# EAGLE design DenScript 5x5 Strip Board (EAGLE 9.3.0)
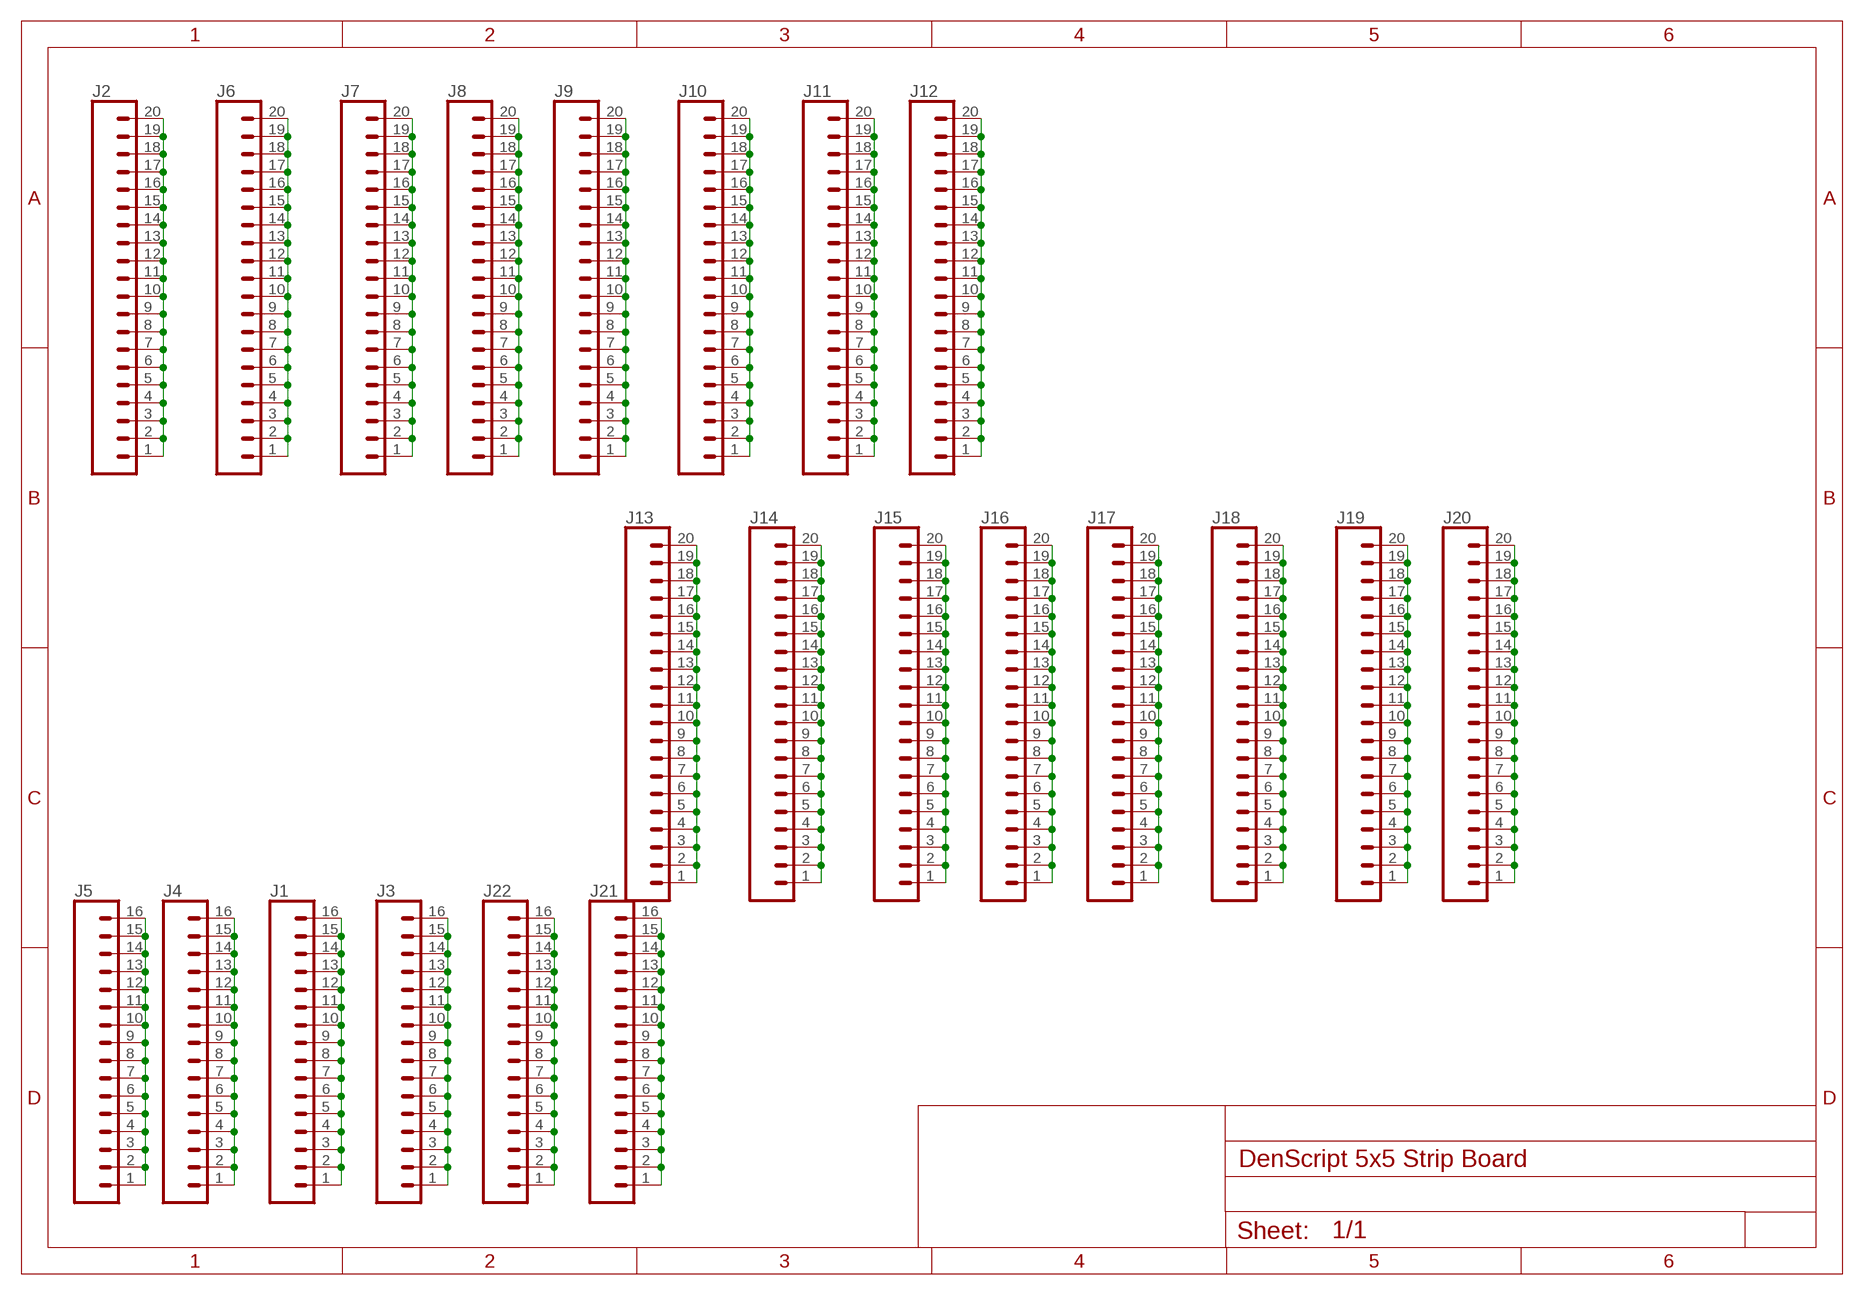
[diagram p0: schematic, sheet 1]

## Parts
J1  CONN_161X16_NO_SILK  [1X16_NO_SILK]
J2  CONN_20NOSILK  [1X20_NOSILK]
J3  CONN_161X16_NO_SILK  [1X16_NO_SILK]
J4  CONN_161X16_NO_SILK  [1X16_NO_SILK]
J5  CONN_161X16_NO_SILK  [1X16_NO_SILK]
J6  CONN_20NOSILK  [1X20_NOSILK]
J7  CONN_20NOSILK  [1X20_NOSILK]
J8  CONN_20NOSILK  [1X20_NOSILK]
J9  CONN_20NOSILK  [1X20_NOSILK]
J10  CONN_20NOSILK  [1X20_NOSILK]
J11  CONN_20NOSILK  [1X20_NOSILK]
J12  CONN_20NOSILK  [1X20_NOSILK]
J13  CONN_20NOSILK  [1X20_NOSILK]
J14  CONN_20NOSILK  [1X20_NOSILK]
J15  CONN_20NOSILK  [1X20_NOSILK]
J16  CONN_20NOSILK  [1X20_NOSILK]
J17  CONN_20NOSILK  [1X20_NOSILK]
J18  CONN_20NOSILK  [1X20_NOSILK]
J19  CONN_20NOSILK  [1X20_NOSILK]
J20  CONN_20NOSILK  [1X20_NOSILK]
J21  CONN_161X16_NO_SILK  [1X16_NO_SILK]
J22  CONN_161X16_NO_SILK  [1X16_NO_SILK]

## Nets
N$1: J3.1 J3.2 J3.3 J3.4 J3.5 J3.6 J3.7 J3.8 J3.9 J3.10 J3.11 J3.12 J3.13 J3.14 J3.15 J3.16
N$2: J1.1 J1.2 J1.3 J1.4 J1.5 J1.6 J1.7 J1.8 J1.9 J1.10 J1.11 J1.12 J1.13 J1.14 J1.15 J1.16
N$3: J4.1 J4.2 J4.3 J4.4 J4.5 J4.6 J4.7 J4.8 J4.9 J4.10 J4.11 J4.12 J4.13 J4.14 J4.15 J4.16
N$4: J5.1 J5.2 J5.3 J5.4 J5.5 J5.6 J5.7 J5.8 J5.9 J5.10 J5.11 J5.12 J5.13 J5.14 J5.15 J5.16
N$5: J2.1 J2.2 J2.3 J2.4 J2.5 J2.6 J2.7 J2.8 J2.9 J2.10 J2.11 J2.12 J2.13 J2.14 J2.15 J2.16 J2.17 J2.18 J2.19 J2.20
N$6: J6.1 J6.2 J6.3 J6.4 J6.5 J6.6 J6.7 J6.8 J6.9 J6.10 J6.11 J6.12 J6.13 J6.14 J6.15 J6.16 J6.17 J6.18 J6.19 J6.20
N$7: J7.1 J7.2 J7.3 J7.4 J7.5 J7.6 J7.7 J7.8 J7.9 J7.10 J7.11 J7.12 J7.13 J7.14 J7.15 J7.16 J7.17 J7.18 J7.19 J7.20
N$8: J8.1 J8.2 J8.3 J8.4 J8.5 J8.6 J8.7 J8.8 J8.9 J8.10 J8.11 J8.12 J8.13 J8.14 J8.15 J8.16 J8.17 J8.18 J8.19 J8.20
N$9: J9.1 J9.2 J9.3 J9.4 J9.5 J9.6 J9.7 J9.8 J9.9 J9.10 J9.11 J9.12 J9.13 J9.14 J9.15 J9.16 J9.17 J9.18 J9.19 J9.20
N$10: J10.1 J10.2 J10.3 J10.4 J10.5 J10.6 J10.7 J10.8 J10.9 J10.10 J10.11 J10.12 J10.13 J10.14 J10.15 J10.16 J10.17 J10.18 J10.19 J10.20
N$11: J11.1 J11.2 J11.3 J11.4 J11.5 J11.6 J11.7 J11.8 J11.9 J11.10 J11.11 J11.12 J11.13 J11.14 J11.15 J11.16 J11.17 J11.18 J11.19 J11.20
N$12: J12.1 J12.2 J12.3 J12.4 J12.5 J12.6 J12.7 J12.8 J12.9 J12.10 J12.11 J12.12 J12.13 J12.14 J12.15 J12.16 J12.17 J12.18 J12.19 J12.20
N$13: J13.1 J13.2 J13.3 J13.4 J13.5 J13.6 J13.7 J13.8 J13.9 J13.10 J13.11 J13.12 J13.13 J13.14 J13.15 J13.16 J13.17 J13.18 J13.19 J13.20
N$14: J14.1 J14.2 J14.3 J14.4 J14.5 J14.6 J14.7 J14.8 J14.9 J14.10 J14.11 J14.12 J14.13 J14.14 J14.15 J14.16 J14.17 J14.18 J14.19 J14.20
N$15: J15.1 J15.2 J15.3 J15.4 J15.5 J15.6 J15.7 J15.8 J15.9 J15.10 J15.11 J15.12 J15.13 J15.14 J15.15 J15.16 J15.17 J15.18 J15.19 J15.20
N$16: J16.1 J16.2 J16.3 J16.4 J16.5 J16.6 J16.7 J16.8 J16.9 J16.10 J16.11 J16.12 J16.13 J16.14 J16.15 J16.16 J16.17 J16.18 J16.19 J16.20
N$17: J17.1 J17.2 J17.3 J17.4 J17.5 J17.6 J17.7 J17.8 J17.9 J17.10 J17.11 J17.12 J17.13 J17.14 J17.15 J17.16 J17.17 J17.18 J17.19 J17.20
N$18: J18.1 J18.2 J18.3 J18.4 J18.5 J18.6 J18.7 J18.8 J18.9 J18.10 J18.11 J18.12 J18.13 J18.14 J18.15 J18.16 J18.17 J18.18 J18.19 J18.20
N$19: J19.1 J19.2 J19.3 J19.4 J19.5 J19.6 J19.7 J19.8 J19.9 J19.10 J19.11 J19.12 J19.13 J19.14 J19.15 J19.16 J19.17 J19.18 J19.19 J19.20
N$20: J20.1 J20.2 J20.3 J20.4 J20.5 J20.6 J20.7 J20.8 J20.9 J20.10 J20.11 J20.12 J20.13 J20.14 J20.15 J20.16 J20.17 J20.18 J20.19 J20.20
N$21: J21.1 J21.2 J21.3 J21.4 J21.5 J21.6 J21.7 J21.8 J21.9 J21.10 J21.11 J21.12 J21.13 J21.14 J21.15 J21.16
N$22: J22.1 J22.2 J22.3 J22.4 J22.5 J22.6 J22.7 J22.8 J22.9 J22.10 J22.11 J22.12 J22.13 J22.14 J22.15 J22.16

## Library data of the parts
J1 J3-J5 J21 J22 = SparkFun-Connectors:CONN_16: Multi connection point. Often used as Generic Header-pin footprint for 0.1 inch spaced/style header connections On any of the 0.1 inch spaced packages, you can populate with these: Break Away Headers - Straight <https://www.sparkfun.com/products/116> (PRT-00116) Break Away Male Headers - Right Angle <https://www.sparkfun.com/products/553> (PRT-00553) Female Headers <https://www.sparkfun.com/products/115> (PRT-00115) Break Away Headers - Machine Pin <https://www.sparkfun.com/products/117> (PRT-00117) Break Away Female Headers - Swiss Machine Pin <https://www.sparkfun.com/products/743> (PRT-00743) For SCREWTERMINALS and SPRING TERMINALS visit here: Screw Terimnals on SparkFun.com <https://www.sparkfun.com/search/results?term=Screw+Terminals> (5mm/3.5mm/2.54mm spacing) This device is also useful as a general connection point to wire up your design to another part of your project. Our various solder wires solder well into these plated through hole pads. Hook-Up Wire - Assortment (Stranded, 22 AWG) <https://www.sparkfun.com/products/11375> (PRT-11375) Hook-Up Wire - Assortment (Solid Core, 22 AWG) <https://www.sparkfun.com/products/11367> (PRT-11367) View the entire wire category on our website here <https://www.sparkfun.com/categories/141> Special notes: Molex polarized connector foot print use with SKU : PRT-08231 with associated crimp pins and housings. 1MM SMD Version SKU: PRT-10208 NOTES ON THE VARIANTS LOCK and LOCK_LONGPADS... This footprint was designed to help hold the alignment of a through-hole component (i.e. 6-pin header) while soldering it into place. You may notice that each hole has been shifted either up or down by 0.005 of an inch from it's more standard position (which is a perfectly straight line). This slight alteration caused the pins (the squares in the middle) to touch the edges of the holes. Because they are alternating, it causes a "brace" to hold the component in place. 0.005 has proven to be the perfect amount of "off-center" position when using our standard breakaway headers. Although looks a little odd when you look at the bare footprint, once you have a header in there, the alteration is very hard to notice. Also,if you push a header all the way into place, it is covered up entirely on the bottom side.
J2 J6-J20 = SparkFun-Connectors:CONN_20: Multi connection point. Often used as Generic Header-pin footprint for 0.1 inch spaced/style header connections On any of the 0.1 inch spaced packages, you can populate with these: Break Away Headers - Straight <https://www.sparkfun.com/products/116> (PRT-00116) Break Away Male Headers - Right Angle <https://www.sparkfun.com/products/553> (PRT-00553) Female Headers <https://www.sparkfun.com/products/115> (PRT-00115) Break Away Headers - Machine Pin <https://www.sparkfun.com/products/117> (PRT-00117) Break Away Female Headers - Swiss Machine Pin <https://www.sparkfun.com/products/743> (PRT-00743) For SCREWTERMINALS and SPRING TERMINALS visit here: Screw Terimnals on SparkFun.com <https://www.sparkfun.com/search/results?term=Screw+Terminals> (5mm/3.5mm/2.54mm spacing) This device is also useful as a general connection point to wire up your design to another part of your project. Our various solder wires solder well into these plated through hole pads. Hook-Up Wire - Assortment (Stranded, 22 AWG) <https://www.sparkfun.com/products/11375> (PRT-11375) Hook-Up Wire - Assortment (Solid Core, 22 AWG) <https://www.sparkfun.com/products/11367> (PRT-11367) View the entire wire category on our website here <https://www.sparkfun.com/categories/141> Special notes: Molex polarized connector foot print use with SKU : PRT-08231 with associated crimp pins and housings. 1MM SMD Version SKU: PRT-10208 NOTES ON THE VARIANTS LOCK and LOCK_LONGPADS... This footprint was designed to help hold the alignment of a through-hole component (i.e. 6-pin header) while soldering it into place. You may notice that each hole has been shifted either up or down by 0.005 of an inch from it's more standard position (which is a perfectly straight line). This slight alteration caused the pins (the squares in the middle) to touch the edges of the holes. Because they are alternating, it causes a "brace" to hold the component in place. 0.005 has proven to be the perfect amount of "off-center" position when using our standard breakaway headers. Although looks a little odd when you look at the bare footprint, once you have a header in there, the alteration is very hard to notice. Also,if you push a header all the way into place, it is covered up entirely on the bottom side. Note about LOCK SPECIAL package: This is just like the LOCK variant in that the holes are staggared by 5 mil, but except for the last two holes. They are not altered from the "standard" footprint layout. This is used for a special purpose on the layout of our Graphic LCD Backpack. Make sure you want to use this device before selecting it for you project!

## Board
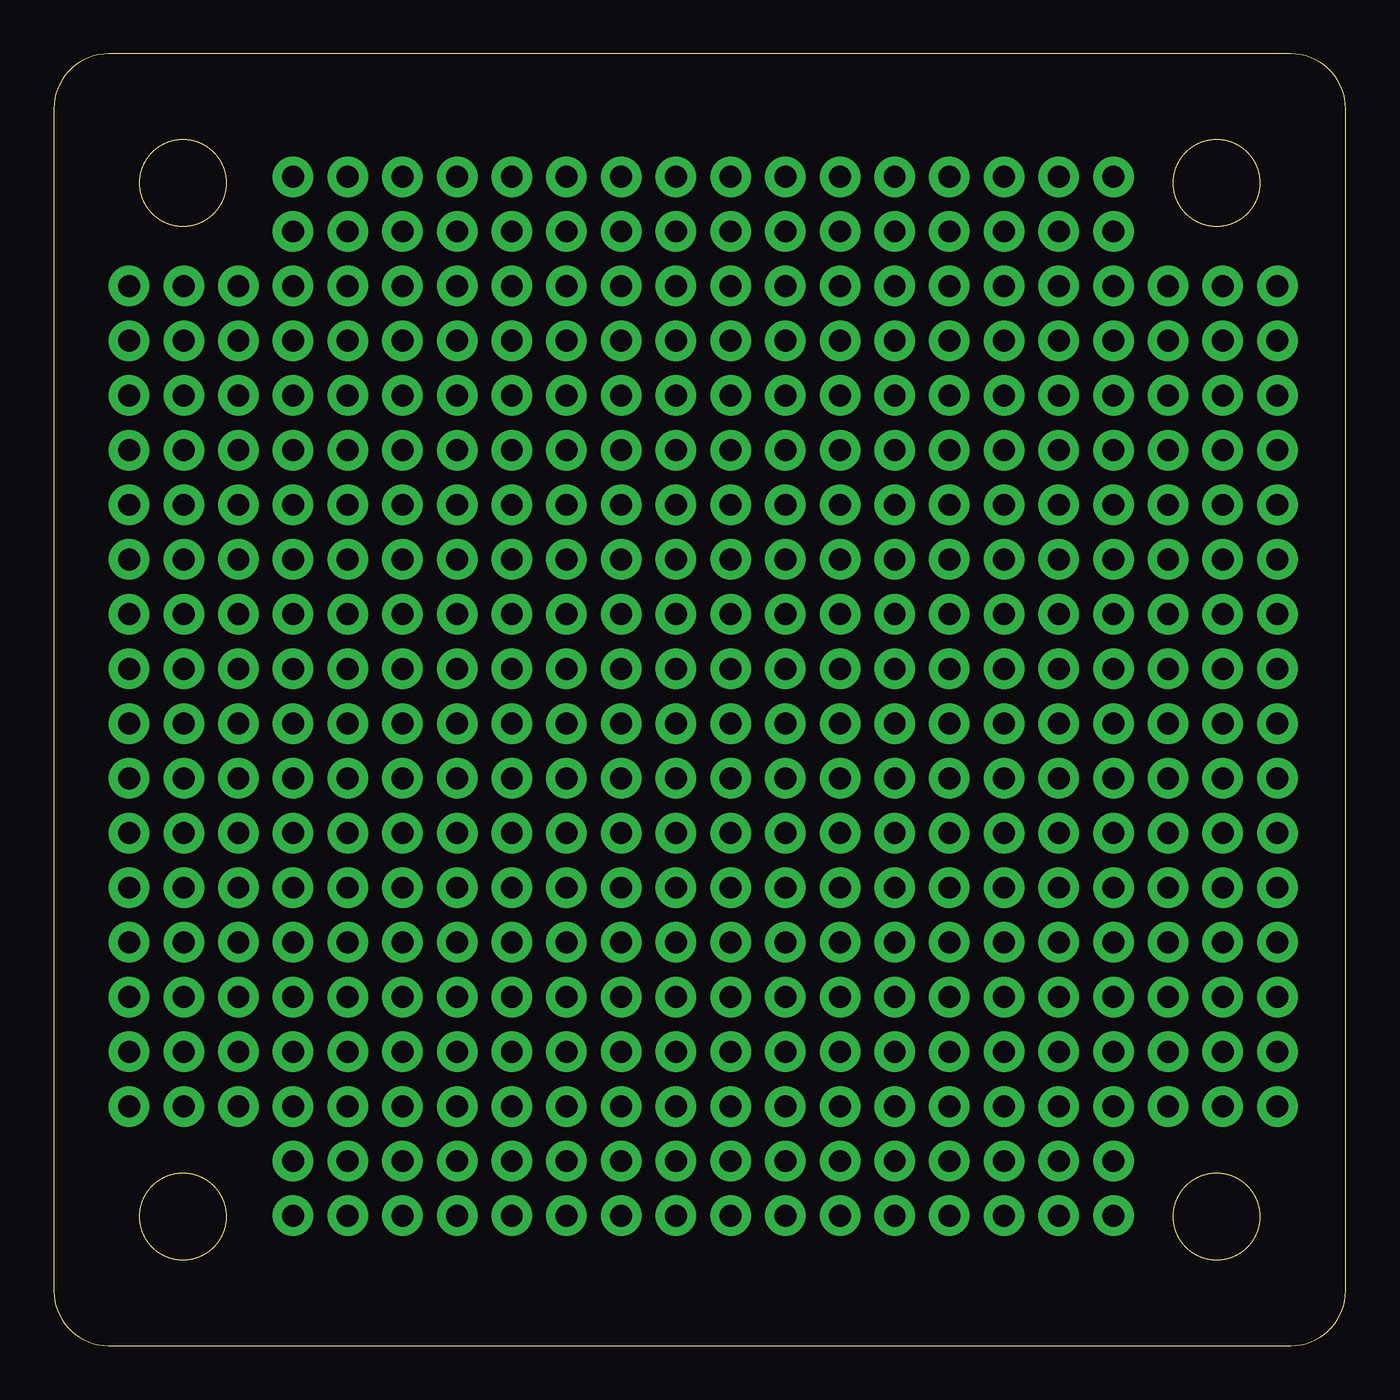
[diagram p1: board, top side]
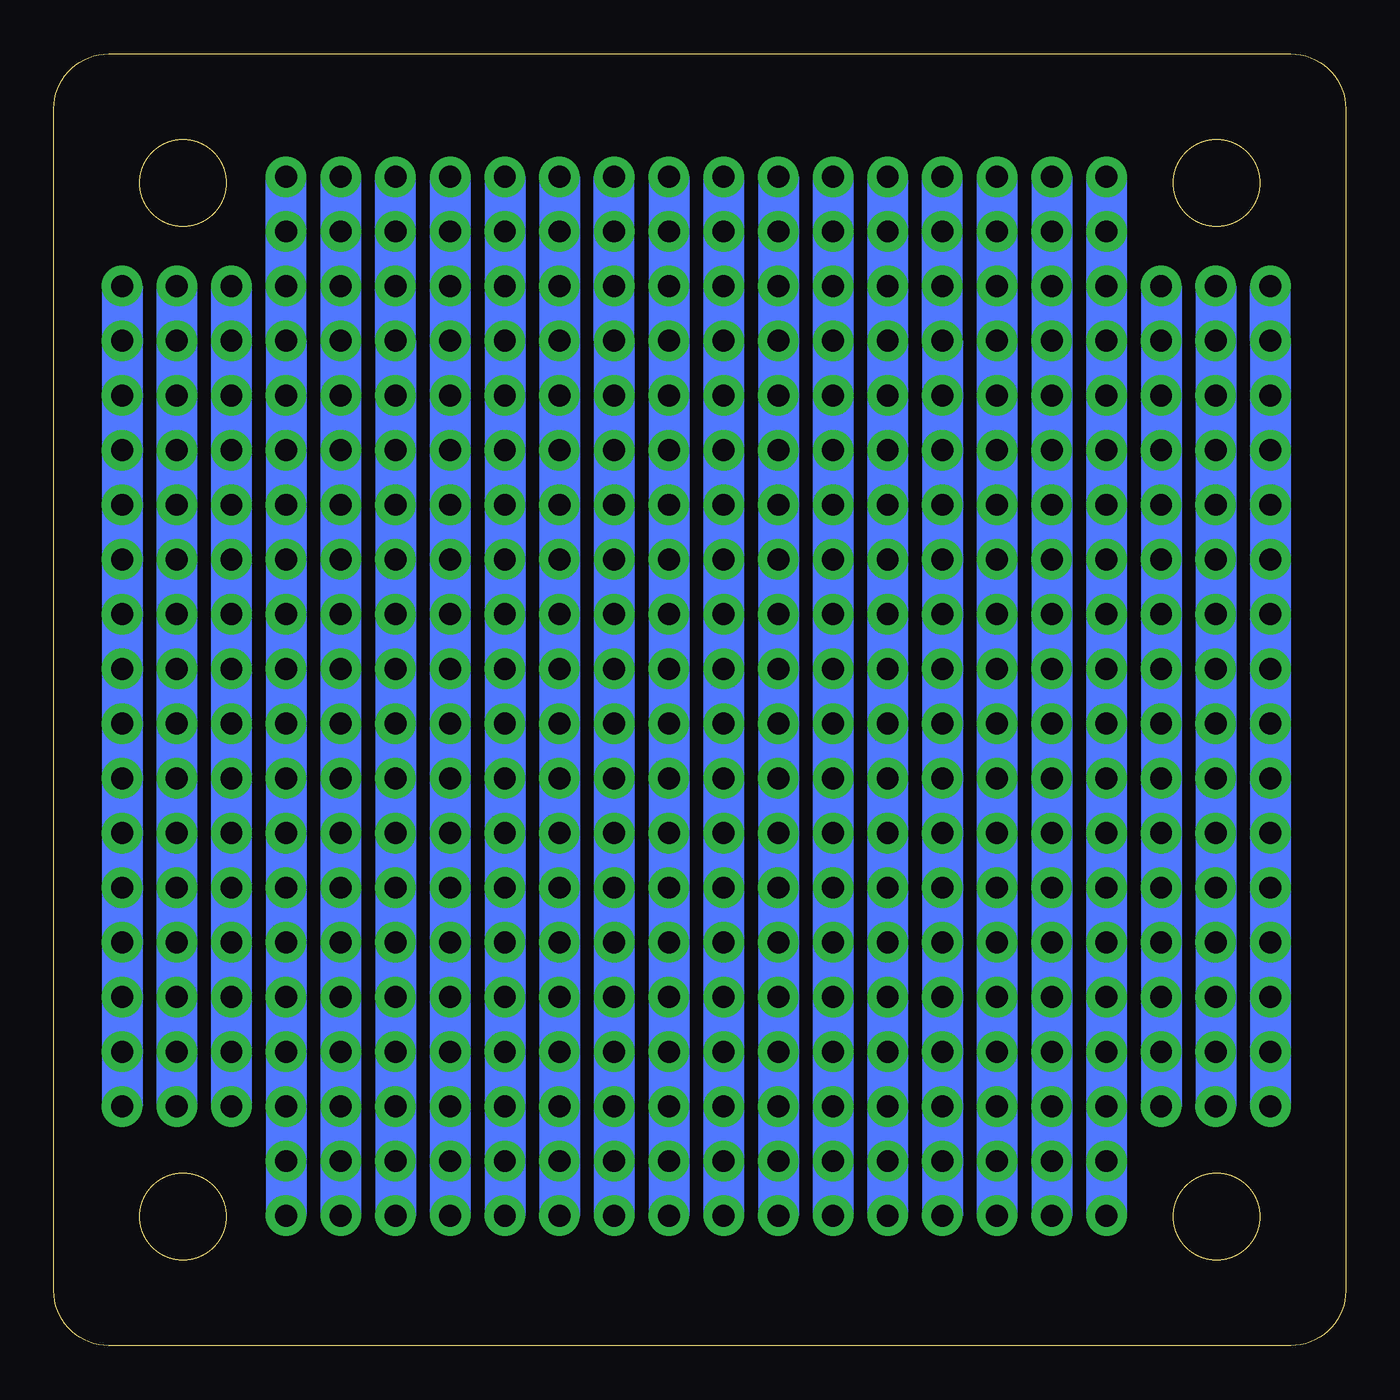
[diagram p2: board, bottom side, seen from below]

Size 60 x 60 mm. Coordinates in mm from the lower left corner, seen from the top.
Outline: 0,57.46 0,2.54 arc90 2.54,0 57.46,0 arc90 60,2.54 60,57.46 arc90 57.46,60 2.54,60 arc90 0,57.46
Outline: circle at 6,54 radius 2
Outline: circle at 6,6 radius 2
Outline: circle at 54,54 radius 2
Outline: circle at 54,6 radius 2
Copper layers (1*16): Top 0.035mm / dielectric 1.5mm / Bottom 0.035mm
Design rules "default": minimum track width 6mil, minimum drill 0.35mm, track to track 6mil, track to pad 6mil, pad to pad 6mil, via to via 6mil, smd to smd 6mil, copper to edge 40mil, drill to drill 6mil, minimum pad ring 10mil, minimum via ring 8mil, stop-mask expansion 4mil, vias tented up to drill 0mil, thermal gap 10mil

### Footprints (pad centres in the part's own frame; a part is rotated, then mirrored left to right if it is on the bottom)
1X16_NO_SILK = drill 1.016 pad 1.88: 1 0,0; 2 2.54,0; 3 5.08,0; 4 7.62,0; 5 10.16,0; 6 12.7,0; 7 15.24,0; 8 17.78,0; 9 20.32,0; 10 22.86,0; 11 25.4,0; 12 27.94,0; 13 30.48,0; 14 33.02,0; 15 35.56,0; 16 38.1,0
1X20_NOSILK = drill 1.016 pad 1.88: 1 0,0; 2 2.54,0; 3 5.08,0; 4 7.62,0; 5 10.16,0; 6 12.7,0; 7 15.24,0; 8 17.78,0; 9 20.32,0; 10 22.86,0; 11 25.4,0; 12 27.94,0; 13 30.48,0; 14 33.02,0; 15 35.56,0; 16 38.1,0; 17 40.64,0; 18 43.18,0; 19 45.72,0; 20 48.26,0

### Placement (x,y rotation side)
J1  6.03,11.11 90 top
J2  11.11,6.03 90 top
J3  8.57,11.11 90 top
J4  3.49,11.11 90 top
J5  51.75,11.11 90 top
J6  13.65,6.03 90 top
J7  16.19,6.03 90 top
J8  18.73,6.03 90 top
J9  21.27,6.03 90 top
J10  23.81,6.03 90 top
J11  26.35,6.03 90 top
J12  28.89,6.03 90 top
J13  31.43,6.03 90 top
J14  49.21,6.03 90 top
J15  46.67,6.03 90 top
J16  44.13,6.03 90 top
J17  41.59,6.03 90 top
J18  39.05,6.03 90 top
J19  36.51,6.03 90 top
J20  33.97,6.03 90 top
J21  54.29,11.11 90 top
J22  56.83,11.11 90 top

### Tracks (layer width: path | path; a pad name or v marks a point on that pad's centre or on a via)
N$1
  Bottom 1.9: J3.16 J3.15 J3.14 J3.13 J3.12 J3.11 J3.10 J3.9 J3.8 J3.7 J3.6 J3.5 J3.4 J3.3 J3.2 J3.1
N$2
  Bottom 1.9: J1.16 J1.15 J1.14 J1.13 J1.12 J1.11 J1.10 J1.9 J1.8 J1.7 J1.6 J1.5 J1.4 J1.3 J1.2 J1.1
N$3
  Bottom 1.9: J4.1 J4.2 J4.3 J4.4 J4.5 J4.6 J4.7 J4.8 J4.9 J4.10 J4.11 J4.12 J4.13 J4.14 J4.15 J4.16
N$4
  Bottom 1.9: J5.16 J5.15 J5.14 J5.13 J5.12 J5.11 J5.10 J5.9 J5.8 J5.7 J5.6 J5.5 J5.4 J5.3 J5.2 J5.1
N$5
  Bottom 1.9: J2.1 J2.2 J2.3 J2.4 J2.5 J2.6 J2.7 J2.8 J2.9 J2.10 J2.11 J2.12 J2.13 J2.14 J2.15 J2.16 J2.17 J2.18 J2.19 J2.20
N$6
  Bottom 1.9: J6.1 J6.2 J6.3 J6.4 J6.5 J6.6 J6.7 J6.8 J6.9 J6.10 J6.11 J6.12 J6.13 J6.14 J6.15 J6.16 J6.17 J6.18 J6.19 J6.20
N$7
  Bottom 1.9: J7.1 J7.2 J7.3 J7.4 J7.5 J7.6 J7.7 J7.8 J7.9 J7.10 J7.11 J7.12 J7.13 J7.14 J7.15 J7.16 J7.17 J7.18 J7.19 J7.20
N$8
  Bottom 1.9: J8.1 J8.2 J8.3 J8.4 J8.5 J8.6 J8.7 J8.8 J8.9 J8.10 J8.11 J8.12 J8.13 J8.14 J8.15 J8.16 J8.17 J8.18 J8.19 J8.20
N$9
  Bottom 1.9: J9.1 J9.2 J9.3 J9.4 J9.5 J9.6 J9.7 J9.8 J9.9 J9.10 J9.11 J9.12 J9.13 J9.14 J9.15 J9.16 J9.17 J9.18 J9.19 J9.20
N$10
  Bottom 1.9: J10.1 J10.2 J10.3 J10.4 J10.5 J10.6 J10.7 J10.8 J10.9 J10.10 J10.11 J10.12 J10.13 J10.14 J10.15 J10.16 J10.17 J10.18 J10.19 J10.20
N$11
  Bottom 1.9: J11.1 J11.2 J11.3 J11.4 J11.5 J11.6 J11.7 J11.8 J11.9 J11.10 J11.11 J11.12 J11.13 J11.14 J11.15 J11.16 J11.17 J11.18 J11.19 J11.20
N$12
  Bottom 1.9: J12.1 J12.2 J12.3 J12.4 J12.5 J12.6 J12.7 J12.8 J12.9 J12.10 J12.11 J12.12 J12.13 J12.14 J12.15 J12.16 J12.17 J12.18 J12.19 J12.20
N$13
  Bottom 1.9: J13.1 J13.2 J13.3 J13.4 J13.5 J13.6 J13.7 J13.8 J13.9 J13.10 J13.11 J13.12 J13.13 J13.14 J13.15 J13.16 J13.17 J13.18 J13.19 J13.20
N$14
  Bottom 1.9: J14.1 J14.2 J14.3 J14.4 J14.5 J14.6 J14.7 J14.8 J14.9 J14.10 J14.11 J14.12 J14.13 J14.14 J14.15 J14.16 J14.17 J14.18 J14.19 J14.20
N$15
  Bottom 1.9: J15.1 J15.2 J15.3 J15.4 J15.5 J15.6 J15.7 J15.8 J15.9 J15.10 J15.11 J15.12 J15.13 J15.14 J15.15 J15.16 J15.17 J15.18 J15.19 J15.20
N$16
  Bottom 1.9: J16.1 J16.2 J16.3 J16.4 J16.5 J16.6 J16.7 J16.8 J16.9 J16.10 J16.11 J16.12 J16.13 J16.14 J16.15 J16.16 J16.17 J16.18 J16.19 J16.20
N$17
  Bottom 1.9: J17.1 J17.2 J17.3 J17.4 J17.5 J17.6 J17.7 J17.8 J17.9 J17.10 J17.11 J17.12 J17.13 J17.14 J17.15 J17.16 J17.17 J17.18 J17.19 J17.20
N$18
  Bottom 1.9: J18.1 J18.2 J18.3 J18.4 J18.5 J18.6 J18.7 J18.8 J18.9 J18.10 J18.11 J18.12 J18.13 J18.14 J18.15 J18.16 J18.17 J18.18 J18.19 J18.20
N$19
  Bottom 1.9: J19.1 J19.2 J19.3 J19.4 J19.5 J19.6 J19.7 J19.8 J19.9 J19.10 J19.11 J19.12 J19.13 J19.14 J19.15 J19.16 J19.17 J19.18 J19.19 J19.20
N$20
  Bottom 1.9: J20.1 J20.2 J20.3 J20.4 J20.5 J20.6 J20.7 J20.8 J20.9 J20.10 J20.11 J20.12 J20.13 J20.14 J20.15 J20.16 J20.17 J20.18 J20.19 J20.20
N$21
  Bottom 1.9: J21.16 J21.15 J21.14 J21.13 J21.12 J21.11 J21.10 J21.9 J21.8 J21.7 J21.6 J21.5 J21.4 J21.3 J21.2 J21.1
N$22
  Bottom 1.9: J22.1 J22.2 J22.3 J22.4 J22.5 J22.6 J22.7 J22.8 J22.9 J22.10 J22.11 J22.12 J22.13 J22.14 J22.15 J22.16